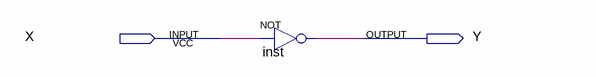
[diagram p0: schematic sheet]
// Quartus schematic CongNOT.bdf as structural Verilog: 1 symbols, 2 pins
module CongNOT (
  input  X,
  output Y
);

  not inst (Y, X);
endmodule
